# EAGLE design untitled2 (EAGLE 7.2.0)
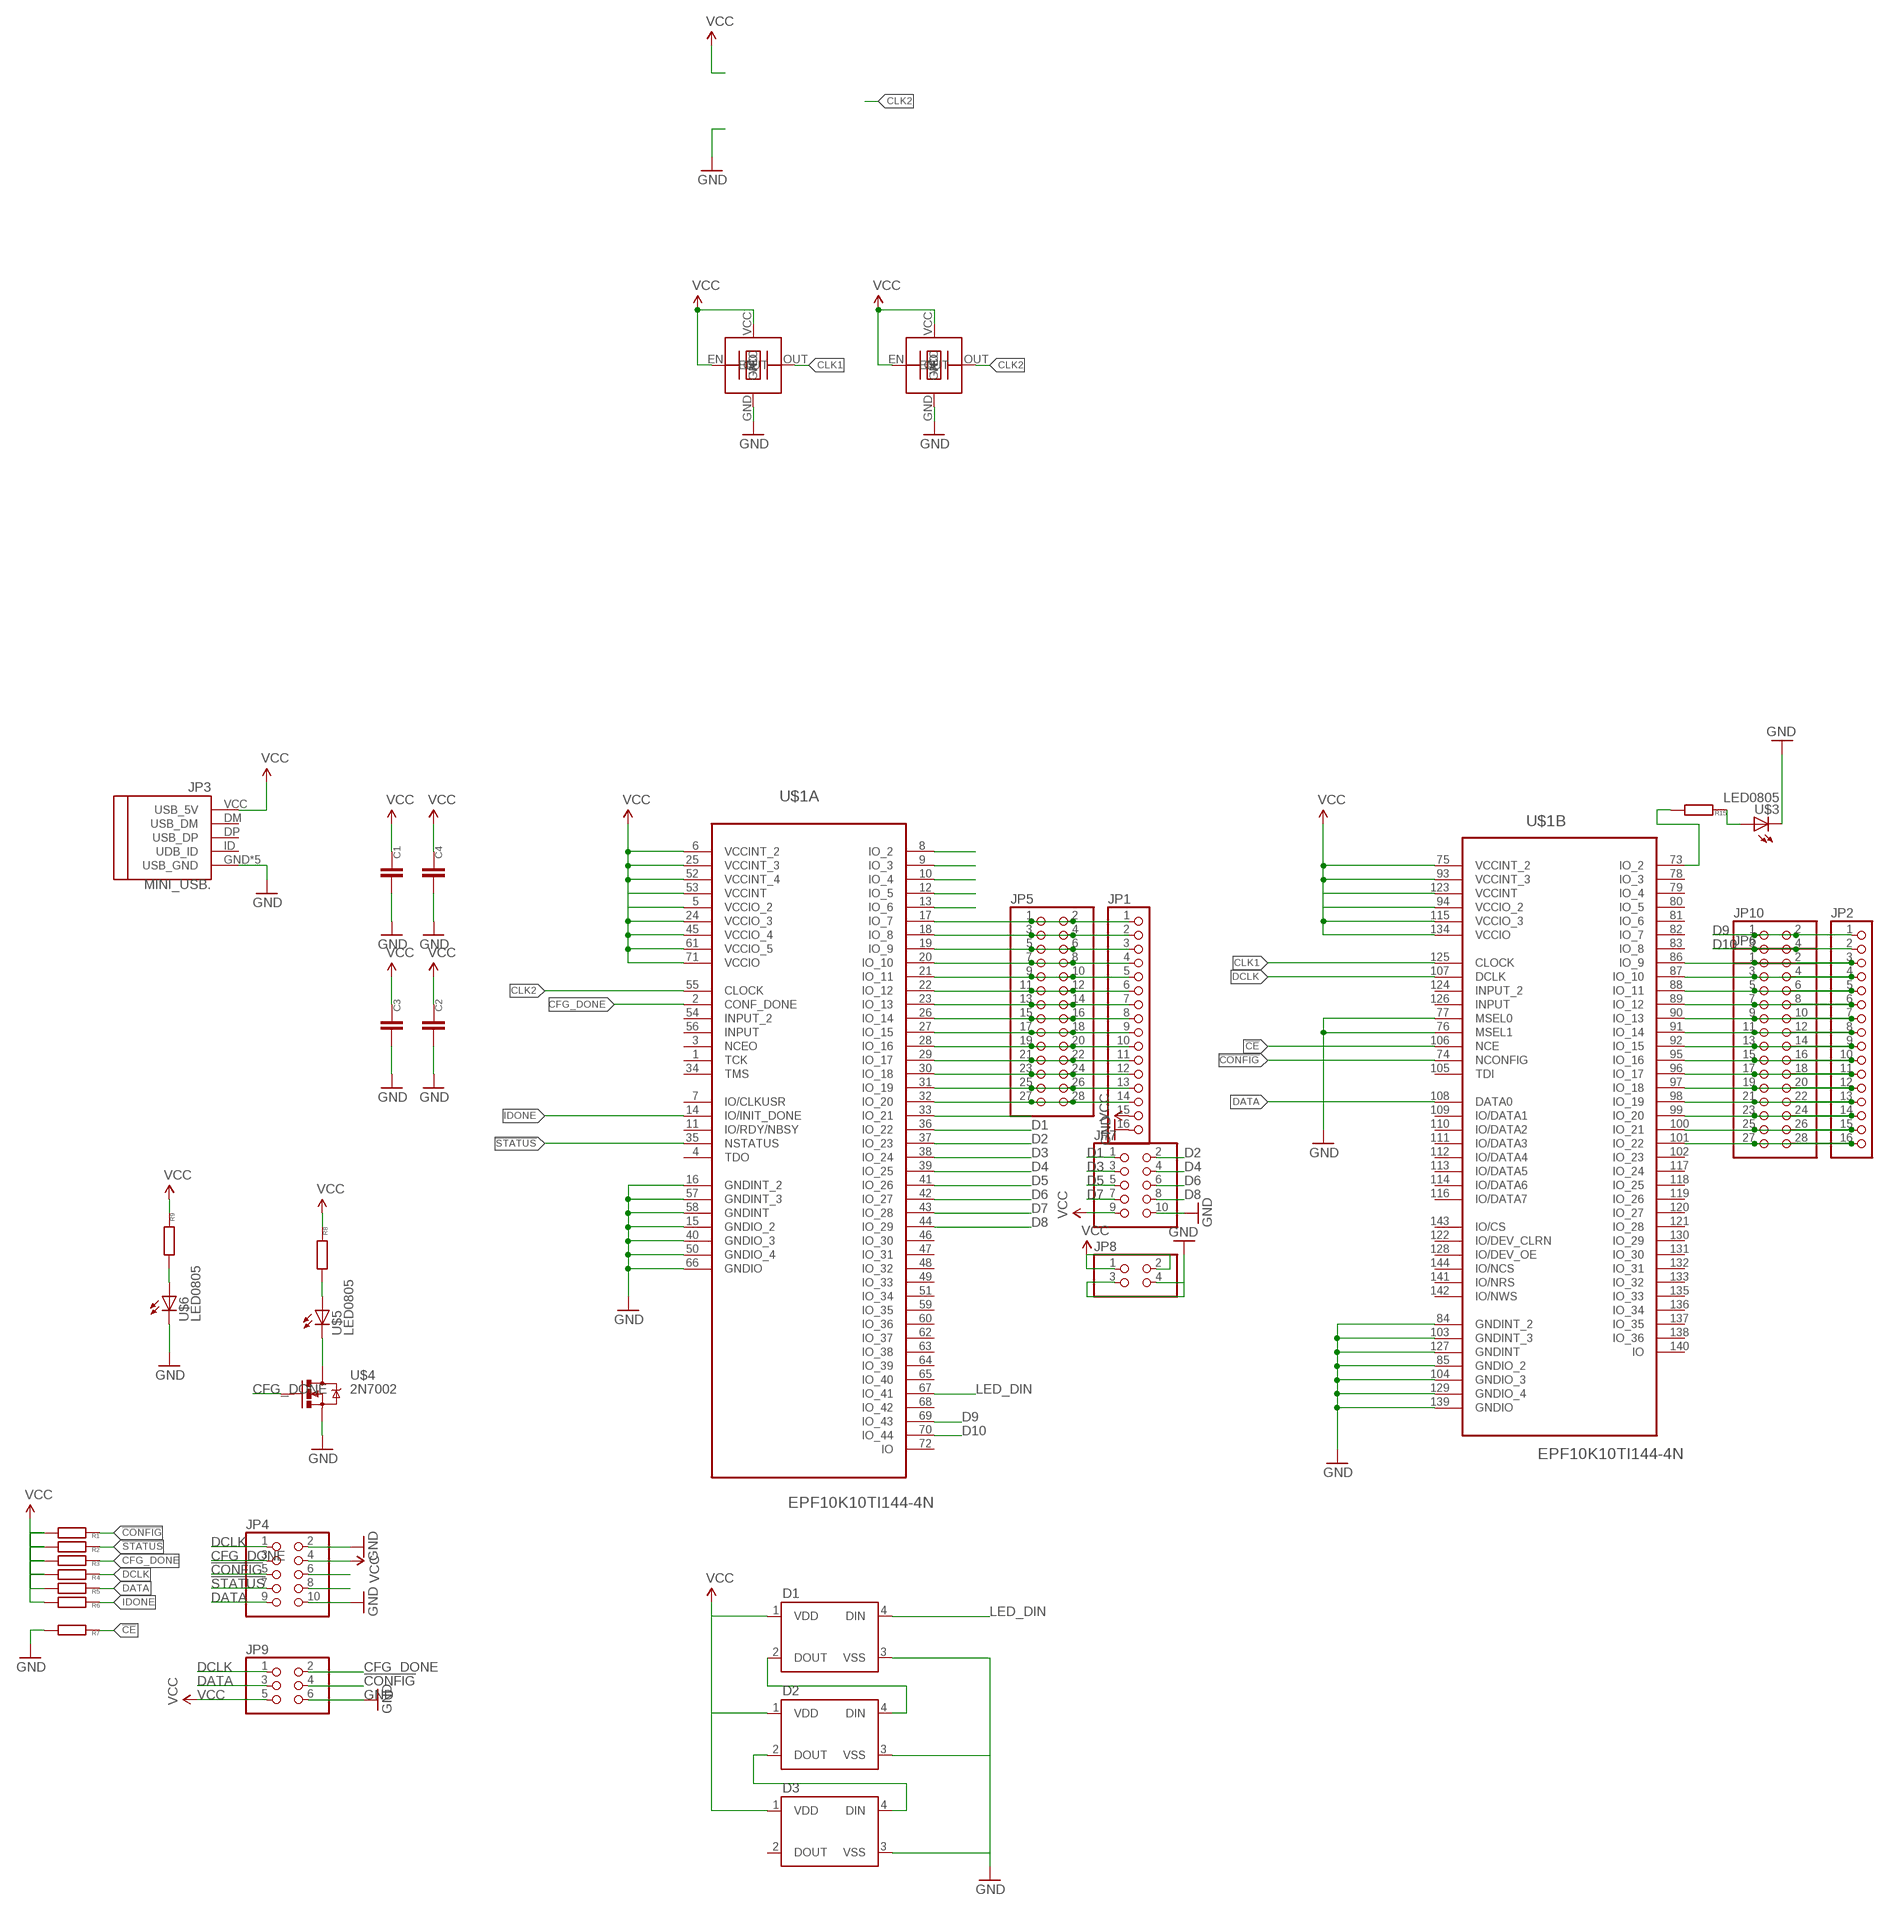
[diagram p0: schematic, sheet 1]

## Parts
C1  CC0805  [C0805]
C2  CC0805  [C0805]
C3  CC0805  [C0805]
C4  CC0805  [C0805]
D1  WS2812B  [WS2812B]
D2  WS2812B  [WS2812B]
D3  WS2812B  [WS2812B]
JP1  PINHD-1X16_2.54  [1X16]
JP2  PINHD-1X16_2.54  [1X16]
JP3  MINI_USB.  [32005-201]
JP4  PINHD-2X05_2.54-SMD  [2X05SMD]
JP5  PINHD-2X14_2.54-SMD  [2X14SMD]
JP6  PINHD-2X14_2.54-SMD  [2X14SMD]
JP7  PINHD-2X05_2.54-SMD  [2X05SMD]
JP8  PINHD-2X02_2.54-SMD  [2X02SMD]
JP9  PINHD-2X03_2.54-SMD  [2X03SMD]
JP10  PINHD-2X02_2.54-SMD  [2X02SMD]
R1  R0603  [0603]
R2  R0603  [0603]
R3  R0603  [0603]
R4  R0603  [0603]
R5  R0603  [0603]
R6  R0603  [0603]
R7  R0603  [0603]
R8  R0603  [0603]
R9  R0603  [0603]
R15  R0603  [0603]
U$1  EPF10K10TI144-4N  [QFP50P2200X2200X160-144N]
U$2  TXC-BA  [7X5]
U$3  LED0805  [0805-LED]
U$4  2N7002  [SOT23]
U$5  LED0805  [0805-LED]
U$6  LED0805  [0805-LED]
U$7  TXC-BA  [7X5]

## Nets
!CE: R7.1 U$1.106(B:NCE)
!CONFIG: JP4.5 JP9.4 R1.1 U$1.74(B:NCONFIG)
!STATUS: JP4.7 R2.1 U$1.35(A:NSTATUS)
CFG_DONE: JP4.3 JP9.2 R3.1 U$1.2(A:CONF_DONE) U$4.1(G)
CLK1: U$1.125(B:CLOCK) U$2.OUT
CLK2: U$1.55(A:CLOCK) U$7.OUT
D1: JP7.1 U$1.36(A:IO_22)
D2: JP7.2 U$1.37(A:IO_23)
D3: JP7.3 U$1.38(A:IO_24)
D4: JP7.4 U$1.39(A:IO_25)
D5: JP7.5 U$1.41(A:IO_26)
D6: JP7.6 U$1.42(A:IO_27)
D7: JP7.7 U$1.43(A:IO_28)
D8: JP7.8 U$1.44(A:IO_29)
D9: JP2.1 JP10.1 JP10.2 U$1.69(A:IO_43)
D10: JP2.2 JP10.3 JP10.4 U$1.70(A:IO_44)
DATA: JP4.9 JP9.3 R5.1 U$1.108(B:DATA0)
DCLK: JP4.1 JP9.1 R4.1 U$1.107(B:DCLK)
GND: C1.1 C2.1 C3.1 C4.1 D1.3(VSS) D2.3(VSS) D3.3(VSS) JP1.16 JP3.GND(USB_GND) JP3.M1(USB_GND) JP3.M2(USB_GND) JP3.M3(USB_GND) JP3.M4(USB_GND) JP4.2 JP4.10 JP7.10 JP8.3 JP8.4 JP9.6 R7.2 U$1.15(A:GNDIO_2) U$1.16(A:GNDINT_2) U$1.40(A:GNDIO_3) U$1.50(A:GNDIO_4) U$1.57(A:GNDINT_3) U$1.58(A:GNDINT) U$1.66(A:GNDIO) U$1.76(B:MSEL1) U$1.77(B:MSEL0) U$1.84(B:GNDINT_2) U$1.85(B:GNDIO_2) U$1.103(B:GNDINT_3) U$1.104(B:GNDIO_3) U$1.127(B:GNDINT) U$1.129(B:GNDIO_4) U$1.139(B:GNDIO) U$2.GND U$3.C U$4.2(S) U$6.C U$7.GND
IDONE: R6.1 U$1.14(A:IO/INIT_DONE)
LED_DIN: D1.4(DIN) U$1.67(A:IO_41)
N$1: JP2.11 JP6.17 JP6.18 U$1.96(B:IO_17)
N$3: U$1.8(A:IO_2)
N$4: JP2.12 JP6.19 JP6.20 U$1.97(B:IO_18)
N$7: U$1.9(A:IO_3)
N$8: U$1.10(A:IO_4)
N$9: U$1.12(A:IO_5)
N$10: U$1.13(A:IO_6)
N$11: JP1.1 JP5.1 JP5.2 U$1.17(A:IO_7)
N$12: JP1.2 JP5.3 JP5.4 U$1.18(A:IO_8)
N$13: R15.2 U$1.73(B:IO_2)
N$14: R15.1 U$3.A
N$15: JP2.13 JP6.21 JP6.22 U$1.98(B:IO_19)
N$16: JP1.3 JP5.5 JP5.6 U$1.19(A:IO_9)
N$17: JP1.4 JP5.7 JP5.8 U$1.20(A:IO_10)
N$18: JP1.5 JP5.9 JP5.10 U$1.21(A:IO_11)
N$19: JP1.6 JP5.11 JP5.12 U$1.22(A:IO_12)
N$20: JP1.7 JP5.13 JP5.14 U$1.23(A:IO_13)
N$21: JP1.8 JP5.15 JP5.16 U$1.26(A:IO_14)
N$22: JP1.9 JP5.17 JP5.18 U$1.27(A:IO_15)
N$23: JP1.10 JP5.19 JP5.20 U$1.28(A:IO_16)
N$24: JP1.11 JP5.21 JP5.22 U$1.29(A:IO_17)
N$25: JP1.12 JP5.23 JP5.24 U$1.30(A:IO_18)
N$26: JP1.13 JP5.25 JP5.26 U$1.31(A:IO_19)
N$27: JP1.14 JP5.27 JP5.28 U$1.32(A:IO_20)
N$28: U$1.33(A:IO_21)
N$30: R9.2 U$6.A
N$31: U$4.3(D) U$5.C
N$32: R8.2 U$5.A
N$35: D1.2(DOUT) D2.4(DIN)
N$36: D2.2(DOUT) D3.4(DIN)
N$38: JP2.14 JP6.23 JP6.24 U$1.99(B:IO_20)
N$39: JP2.15 JP6.25 JP6.26 U$1.100(B:IO_21)
N$40: JP2.16 JP6.27 JP6.28 U$1.101(B:IO_22)
N$41: JP2.3 JP6.1 JP6.2 U$1.86(B:IO_9)
N$42: JP2.4 JP6.3 JP6.4 U$1.87(B:IO_10)
N$43: JP2.5 JP6.5 JP6.6 U$1.88(B:IO_11)
N$44: JP2.6 JP6.7 JP6.8 U$1.89(B:IO_12)
N$45: JP2.7 JP6.9 JP6.10 U$1.90(B:IO_13)
N$46: JP2.8 JP6.11 JP6.12 U$1.91(B:IO_14)
N$47: JP2.9 JP6.13 JP6.14 U$1.92(B:IO_15)
N$48: JP2.10 JP6.15 JP6.16 U$1.95(B:IO_16)
N$56: JP4.6
N$57: JP4.8
VCC: C1.2 C2.2 C3.2 C4.2 D1.1(VDD) D2.1(VDD) D3.1(VDD) JP1.15 JP3.VCC(USB_5V) JP4.4 JP7.9 JP8.1 JP8.2 JP9.5 R1.2 R2.2 R3.2 R4.2 R5.2 R6.2 R8.1 R9.1 U$1.5(A:VCCIO_2) U$1.6(A:VCCINT_2) U$1.24(A:VCCIO_3) U$1.25(A:VCCINT_3) U$1.45(A:VCCIO_4) U$1.52(A:VCCINT_4) U$1.53(A:VCCINT) U$1.61(A:VCCIO_5) U$1.71(A:VCCIO) U$1.75(B:VCCINT_2) U$1.93(B:VCCINT_3) U$1.94(B:VCCIO_2) U$1.115(B:VCCIO_3) U$1.123(B:VCCINT) U$1.134(B:VCCIO) U$2.EN U$2.VCC U$7.EN U$7.VCC
Unconnected: D3.2(DOUT) JP3.DM(USB_DM) JP3.DP(USB_DP) JP3.ID(UDB_ID) U$1.1(A:TCK) U$1.3(A:NCEO) U$1.4(A:TDO) U$1.7(A:IO/CLKUSR) U$1.11(A:IO/RDY/NBSY) U$1.34(A:TMS) U$1.46(A:IO_30) U$1.47(A:IO_31) U$1.48(A:IO_32) U$1.49(A:IO_33) U$1.51(A:IO_34) U$1.54(A:INPUT_2) U$1.56(A:INPUT) U$1.59(A:IO_35) U$1.60(A:IO_36) U$1.62(A:IO_37) U$1.63(A:IO_38) U$1.64(A:IO_39) U$1.65(A:IO_40) U$1.68(A:IO_42) U$1.72(A:IO) U$1.78(B:IO_3) U$1.79(B:IO_4) U$1.80(B:IO_5) U$1.81(B:IO_6) U$1.82(B:IO_7) U$1.83(B:IO_8) U$1.102(B:IO_23) U$1.105(B:TDI) U$1.109(B:IO/DATA1) U$1.110(B:IO/DATA2) U$1.111(B:IO/DATA3) U$1.112(B:IO/DATA4) U$1.113(B:IO/DATA5) U$1.114(B:IO/DATA6) U$1.116(B:IO/DATA7) U$1.117(B:IO_24) U$1.118(B:IO_25) U$1.119(B:IO_26) U$1.120(B:IO_27) U$1.121(B:IO_28) U$1.122(B:IO/DEV_CLRN) U$1.124(B:INPUT_2) U$1.126(B:INPUT) U$1.128(B:IO/DEV_OE) U$1.130(B:IO_29) U$1.131(B:IO_30) U$1.132(B:IO_31) U$1.133(B:IO_32) U$1.135(B:IO_33) U$1.136(B:IO_34) U$1.137(B:IO_35) U$1.138(B:IO_36) U$1.140(B:IO) U$1.141(B:IO/NRS) U$1.142(B:IO/NWS) U$1.143(B:IO/CS) U$1.144(B:IO/NCS)

## Library data of the parts
C1-C4 = smalsmd:C: Capacitor
D1-D3 = SparkFun-LED:WS2812B: WS2812B - Intelligent control LED integrated light source Technical Specifications: Power Supply Voltage (VDD): 3.5 to 5.3 V Input Voltage (VI): -0.5 to VDD+0.5 V Operating Junction Temperature (Topt): -25°C to +80°C Storage Temperature Range (Tstg): -55°C to +150°C; PROD_ID: DIO-12503
JP1 JP2 = pinhead-2:PINHD-1X16: PIN HEADER
JP3 = connectors:MINI_USB
JP4 JP7 = pinhead-2:PINHD-2X05: PIN HEADER
JP5 JP6 = pinhead-2:PINHD-2X14: PIN HEADER
JP8 JP10 = pinhead-2:PINHD-2X02: PIN HEADER
JP9 = pinhead-2:PINHD-2X03: PIN HEADER
R1-R9 R15 = smalsmd:R
U$1 = Altera_By_element14_Batch_1:EPF10K10TI144-4N: Embedded Programmable Logic Device; MPN: EPF10K10TI144-4N; OC_FARNELL: -; OC_NEWARK: 51R8776; PACKAGE: QFP-144; SUPPLIER: Altera
U$2 U$7 = txc:TXC-BA**
U$3 U$5 U$6 = smalsmd:LED
U$4 = smalsmd:2N7002

## Board
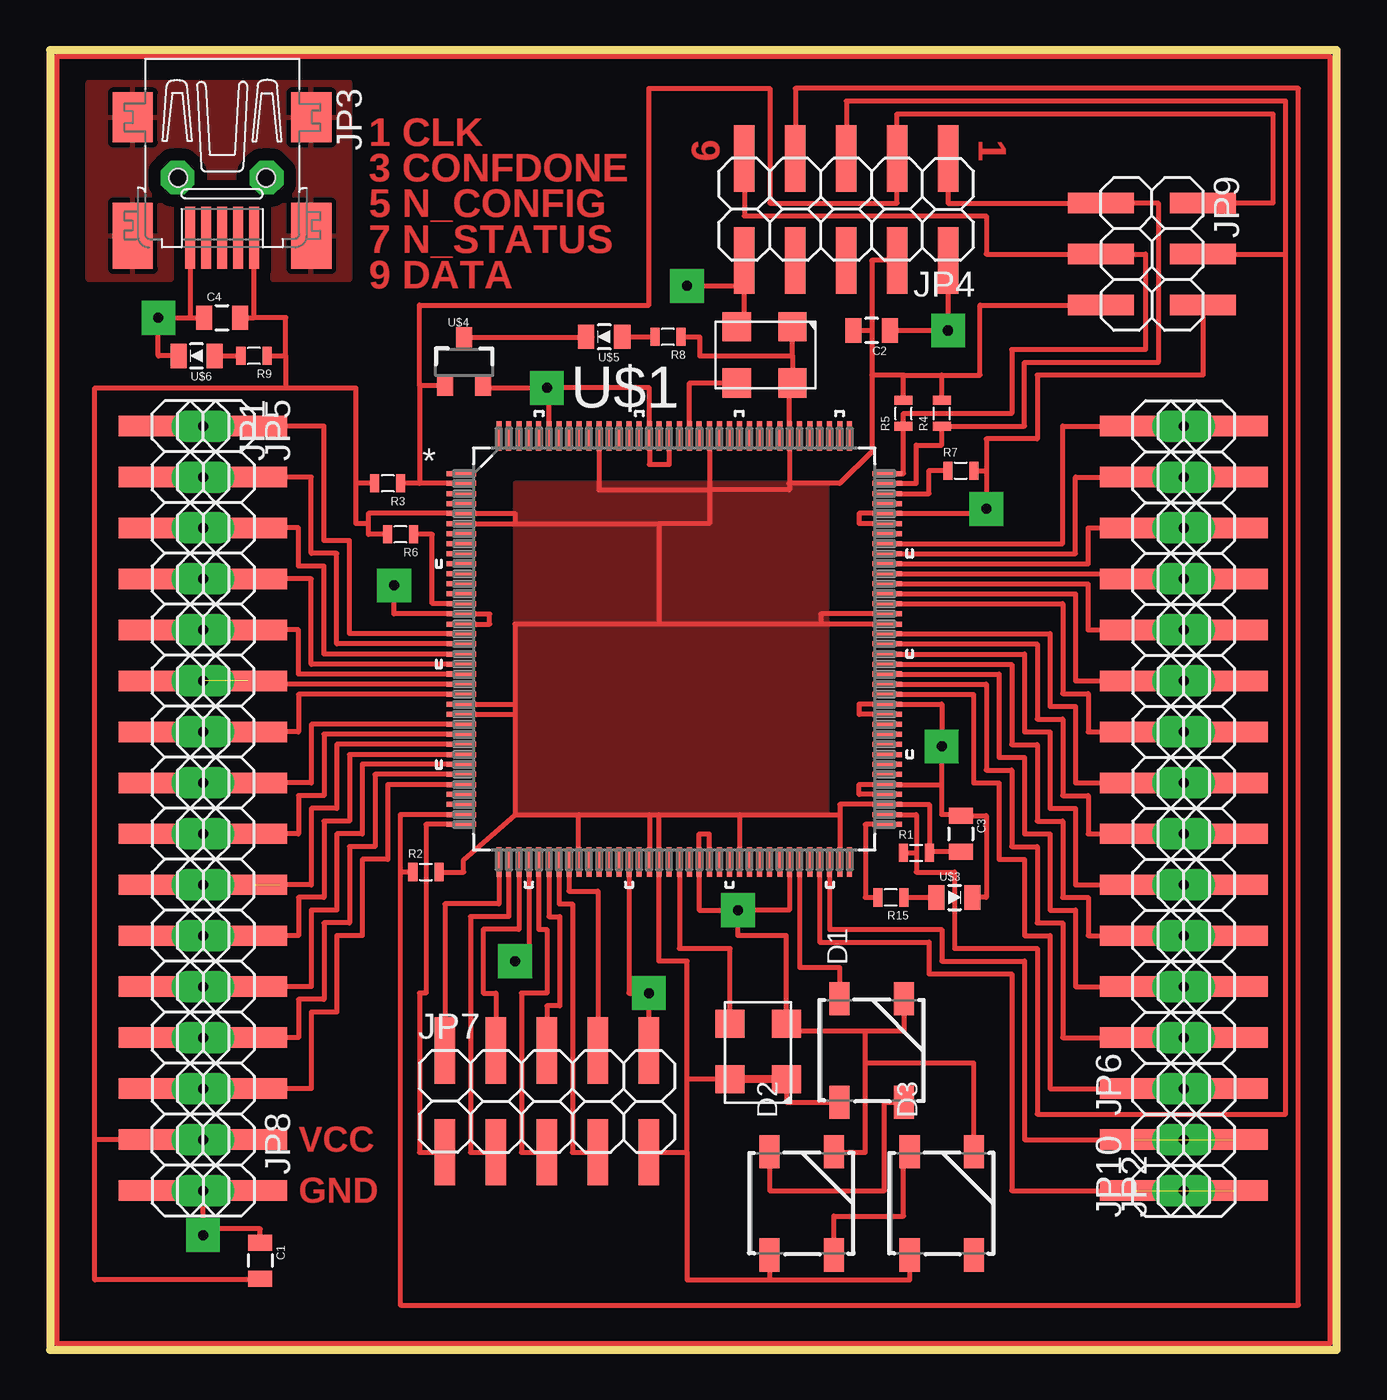
[diagram p1: board, top side]
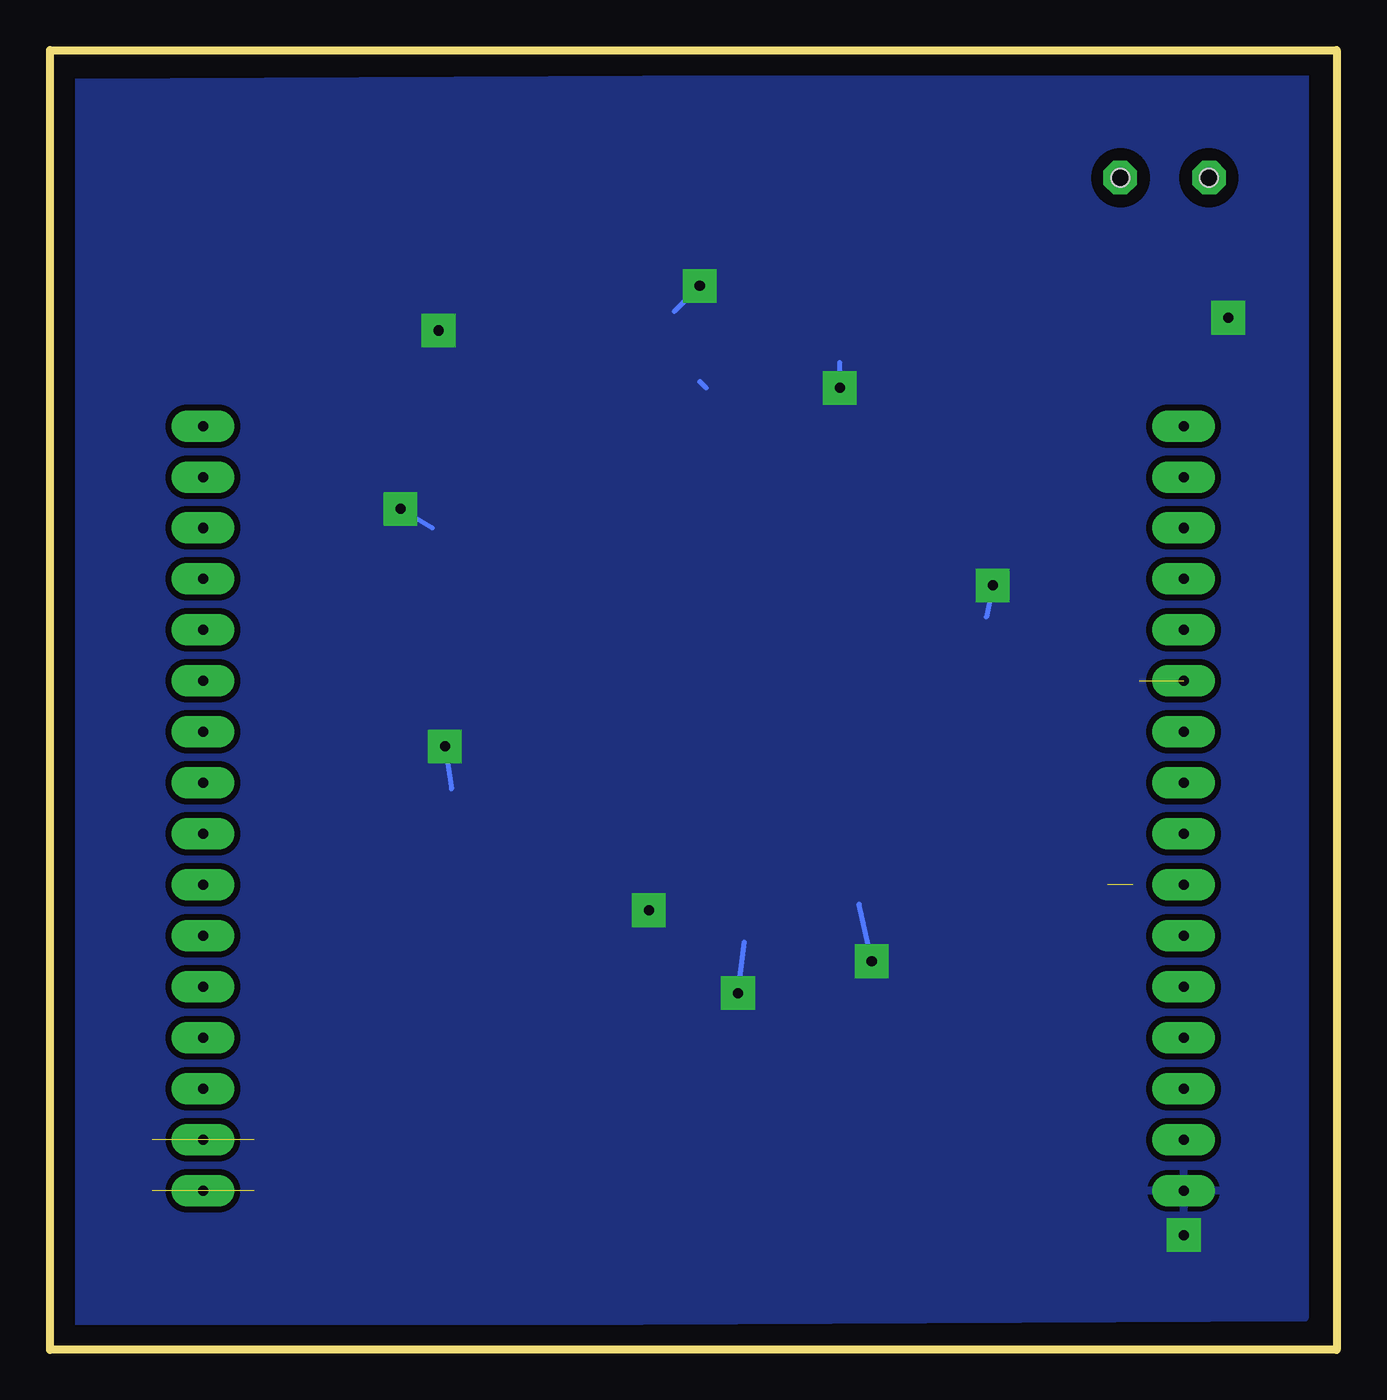
[diagram p2: board, bottom side, seen from below]

Size 64.14 x 64.77 mm. Coordinates in mm from the lower left corner, seen from the top.
Outline: 0,0 64.14,0 64.14,64.77 0,64.77 0,0
Copper layers (1*16): Top 0.035mm / dielectric 1.5mm / Bottom 0.035mm
Design rules "my02": minimum track width 0.2mm, minimum drill 0.2mm, track to track 0.2mm, track to pad 0.2mm, pad to pad 0.2mm, via to via 0.2mm, smd to smd 0.2mm, copper to edge 40mil, drill to drill 8mil, minimum pad ring 10mil, minimum via ring 8mil, stop-mask expansion 4mil, vias tented up to drill 0mil, thermal gap 10mil

### Footprints (pad centres in the part's own frame; a part is rotated, then mirrored left to right if it is on the bottom)
C0805 = smd 0.8 x 1.2: 1 -0.9,0; 2 0.9,0
WS2812B = smd 1.651 x 1: 1 -2.577,1.6; 2 -2.577,-1.6; 3 2.577,-1.6; 4 2.577,1.6
1X16 = drill 0.5 pad 1.57 long: 1 -19.05,0; 2 -16.51,0; 3 -13.97,0; 4 -11.43,0; 5 -8.89,0; 6 -6.35,0; 7 -3.81,0; 8 -1.27,0; 9 1.27,0; 10 3.81,0; 11 6.35,0; 12 8.89,0; 13 11.43,0; 14 13.97,0; 15 16.51,0; 16 19.05,0
32005-201 = smd 3.1 x 0.5: DM 3,0.8; DP 3,0; GND 3,-1.6; ID 3,-0.8; VCC 3,1.6 | smd 2.5 x 2: M1 -3,-4.45; M2 -3,4.45 | smd 3.3 x 2: M3 2.9,4.45; M4 2.9,-4.45 | hole 0.9: 0,2.2; 0,-2.2
2X05SMD = smd 1.016 x 3.302: 1 -1.27,-3.81; 2 -1.27,1.27; 3 1.27,-3.81; 4 1.27,1.27; 5 3.81,-3.81; 6 3.81,1.27; 7 6.35,-3.81; 8 6.35,1.27; 9 8.89,-3.81; 10 8.89,1.27
2X14SMD = smd 1.016 x 3.302: 1 -1.27,-3.81; 2 -1.27,1.27; 3 1.27,-3.81; 4 1.27,1.27; 5 3.81,-3.81; 6 3.81,1.27; 7 6.35,-3.81; 8 6.35,1.27; 9 8.89,-3.81; 10 8.89,1.27; 11 11.43,-3.81; 12 11.43,1.27; 13 13.97,-3.81; 14 13.97,1.27; 15 16.51,-3.81; 16 16.51,1.27; 17 19.05,-3.81; 18 19.05,1.27; 19 21.59,-3.81; 20 21.59,1.27; 21 24.13,-3.81; 22 24.13,1.27; 23 26.67,-3.81; 24 26.67,1.27; 25 29.21,-3.81; 26 29.21,1.27; 27 31.75,-3.81; 28 31.75,1.27
2X02SMD = smd 1.016 x 3.302: 1 -1.27,-3.81; 2 -1.27,1.27; 3 1.27,-3.81; 4 1.27,1.27
2X03SMD = smd 1.016 x 3.302: 1 -1.27,-3.81; 2 -1.27,1.27; 3 1.27,-3.81; 4 1.27,1.27; 5 3.81,-3.81; 6 3.81,1.27
0603 = smd 0.45 x 0.9: 1 -0.65,0; 2 0.65,0
QFP50P2200X2200X160-144N = smd 1.473 x 0.25: 1 -10.617,8.738; 2 -10.617,8.255; 3 -10.617,7.747; 4 -10.617,7.239; 5 -10.617,6.756; 6 -10.617,6.248; 7 -10.617,5.74; 8 -10.617,5.258; 9 -10.617,4.75; 10 -10.617,4.242; 11 -10.617,3.759; 12 -10.617,3.251; 13 -10.617,2.743; 14 -10.617,2.261; 15 -10.617,1.753; 16 -10.617,1.245; 17 -10.617,0.762; 18 -10.617,0.254; 19 -10.617,-0.254; 20 -10.617,-0.762; 21 -10.617,-1.245; 22 -10.617,-1.753; 23 -10.617,-2.261; 24 -10.617,-2.743; 25 -10.617,-3.251; 26 -10.617,-3.759; 27 -10.617,-4.242; 28 -10.617,-4.75; 29 -10.617,-5.258; 30 -10.617,-5.74; 31 -10.617,-6.248; 32 -10.617,-6.756; 33 -10.617,-7.239; 34 -10.617,-7.747; 35 -10.617,-8.255; 36 -10.617,-8.738; 73 10.617,-8.738; 74 10.617,-8.255; 75 10.617,-7.747; 76 10.617,-7.239; 77 10.617,-6.756; 78 10.617,-6.248; 79 10.617,-5.74; 80 10.617,-5.258; 81 10.617,-4.75; 82 10.617,-4.242; 83 10.617,-3.759; 84 10.617,-3.251; 85 10.617,-2.743; 86 10.617,-2.261; 87 10.617,-1.753; 88 10.617,-1.245; 89 10.617,-0.762; 90 10.617,-0.254; 91 10.617,0.254; 92 10.617,0.762; 93 10.617,1.245; 94 10.617,1.753; 95 10.617,2.261; 96 10.617,2.743; 97 10.617,3.251; 98 10.617,3.759; 99 10.617,4.242; 100 10.617,4.75; 101 10.617,5.258; 102 10.617,5.74; 103 10.617,6.248; 104 10.617,6.756; 105 10.617,7.239; 106 10.617,7.747; 107 10.617,8.255; 108 10.617,8.738 | smd 0.25 x 1.473: 37 -8.738,-10.617; 38 -8.255,-10.617; 39 -7.747,-10.617; 40 -7.239,-10.617; 41 -6.756,-10.617; 42 -6.248,-10.617; 43 -5.74,-10.617; 44 -5.258,-10.617; 45 -4.75,-10.617; 46 -4.242,-10.617; 47 -3.759,-10.617; 48 -3.251,-10.617; 49 -2.743,-10.617; 50 -2.261,-10.617; 51 -1.753,-10.617; 52 -1.245,-10.617; 53 -0.762,-10.617; 54 -0.254,-10.617; 55 0.254,-10.617; 56 0.762,-10.617; 57 1.245,-10.617; 58 1.753,-10.617; 59 2.261,-10.617; 60 2.743,-10.617; 61 3.251,-10.617; 62 3.759,-10.617; 63 4.242,-10.617; 64 4.75,-10.617; 65 5.258,-10.617; 66 5.74,-10.617; 67 6.248,-10.617; 68 6.756,-10.617; 69 7.239,-10.617; 70 7.747,-10.617; 71 8.255,-10.617; 72 8.738,-10.617; 109 8.738,10.617; 110 8.255,10.617; 111 7.747,10.617; 112 7.239,10.617; 113 6.756,10.617; 114 6.248,10.617; 115 5.74,10.617; 116 5.258,10.617; 117 4.75,10.617; 118 4.242,10.617; 119 3.759,10.617; 120 3.251,10.617; 121 2.743,10.617; 122 2.261,10.617; 123 1.753,10.617; 124 1.245,10.617; 125 0.762,10.617; 126 0.254,10.617; 127 -0.254,10.617; 128 -0.762,10.617; 129 -1.245,10.617; 130 -1.753,10.617; 131 -2.261,10.617; 132 -2.743,10.617; 133 -3.251,10.617; 134 -3.759,10.617; 135 -4.242,10.617; 136 -4.75,10.617; 137 -5.258,10.617; 138 -5.74,10.617; 139 -6.248,10.617; 140 -6.756,10.617; 141 -7.239,10.617; 142 -7.747,10.617; 143 -8.255,10.617; 144 -8.738,10.617
7X5 = smd 1.4 x 1.45: EN -1.448,-1.465; GND 1.333,-1.465; OUT 1.333,1.345; VCC -1.448,1.345
0805-LED = smd 0.8 x 1.2: A -0.9,0; C 0.9,0
SOT23 = smd 0.8 x 1: 1 -0.95,-1.159; 2 0.95,-1.159; 3 0,1.259

### Placement (x,y rotation side)
C1  10.48,4.45 270 top
C2  40.96,50.8 180 top
C3  45.4,25.72 270 top
C4  8.57,51.44 0 top
D1  40.96,14.92 90 top
D2  37.47,7.3 90 top
D3  44.45,7.3 90 top
JP1  7.62,26.99 270 top
JP2  56.52,26.99 90 top
JP3  8.57,58.42 270 top
JP4  43.5,55.56 180 top
JP5  8.89,44.77 270 top
JP6  55.25,14.29 90 top
JP7  20.95,13.65 0 top
JP8  8.89,9.21 270 top
JP9  56.2,55.88 270 top
JP10  55.25,9.21 90 top
R1  43.18,24.77 0 top
R2  18.73,23.81 0 top
R3  16.83,43.18 180 top
R4  44.45,46.67 90 top
R5  42.55,46.67 90 top
R6  17.46,40.64 180 top
R7  45.4,43.81 0 top
R8  30.8,50.48 180 top
R9  10.16,49.53 180 top
R15  41.91,22.54 180 top
U$1  31.11,34.93 0 top
U$2  TXC-BA*  [7X5]  35.56,49.53 180 top
U$3  45.09,22.54 0 top
U$4  20.64,49.21 0 top
U$5  27.62,50.48 180 top
U$6  7.3,49.53 180 top
U$7  TXC-BA*  [7X5]  35.24,14.92 90 top

### Tracks (layer width: path | path; a pad name or v marks a point on that pad's centre or on a via)
!CE
  Top 0.254: U$1.106 43.82,42.67 43.82,43.81 R7.1
!CONFIG
  Top 0.254: JP4.5 39.69,62.23 61.6,62.23 61.6,54.61 | U$1.74 43.18,26.67 43.18,24.77 | R1.1 43.18,24.77 | 43.18,24.77 43.18,23.81 45.09,23.81 45.09,20 49.21,20 49.21,11.75 61.6,11.75 61.6,54.61 | JP9.4 61.6,54.61
!STATUS
  Top 0.254: U$1.35 17.46,26.67 | JP4.7 37.15,62.87 62.23,62.87 62.23,2.22 17.46,2.22 17.46,23.81 | 17.46,23.81 17.46,26.67 | 17.45,26.67 17.46,26.67 | R2.1 17.46,23.81
CFG_DONE
  Top 0.254: U$4.1 18.41,48.05 | 18.41,48.05 18.41,52.07 29.84,52.07 29.84,62.87 35.88,62.87 35.88,57.15 42.23,57.15 JP4.3 42.23,61.59 60.96,61.59 60.96,57.15 JP9.2 | U$1.2 18.41,43.18 | 18.41,43.18 R3.1 | 18.41,48.05 18.41,43.18
CLK1
  Top 0.254: U$1.125 31.88,48.19 U$2.OUT
CLK2
  Top 0.254: U$1.55 31.37,20 33.9,20 U$7.OUT
D1
  Top 0.254: U$1.36 18.73,26.19 18.73,17.78 18.41,17.78 18.41,9.84 JP7.1
D2
  Top 0.254: U$1.37 22.38,22.23 19.68,22.23 JP7.2
D3
  Top 0.254: U$1.38 22.86,21.59 20.95,21.59 20.95,9.84 JP7.3
D4
  Top 0.254: U$1.39 23.37,20.96 21.59,20.96 21.59,17.78 22.22,17.78 JP7.4
D5
  Top 0.254: U$1.41 24.36,20.96 24.77,20.96 24.77,17.78 23.5,17.78 23.5,9.84 JP7.5
D6
  Top 0.254: U$1.42 24.87,21.59 25.4,21.59 25.4,17.14 24.77,17.14 JP7.6
D7
  Top 0.254: U$1.43 25.38,22.23 26.04,22.23 26.04,9.84 JP7.7
D8
  Top 0.254: U$1.44 25.86,22.86 27.3,22.86 JP7.8
D9  (2 unrouted)
  Top 0.254: U$1.69 38.35,20.32 43.82,20.32 43.82,18.73 47.94,18.73 47.94,7.94 JP2.1
D10  (2 unrouted)
  Top 0.254: U$1.70 38.86,20.96 44.45,20.96 44.45,19.37 48.58,19.37 48.58,10.48 JP2.2
DATA
  Top 0.254: U$1.108 42.55,43.66 R5.1 42.55,46.67 47.94,46.67 47.94,49.85 54.61,49.85 54.61,54.61 JP9.3 46.67,54.61 46.67,56.52 34.61,56.52 JP4.9
DCLK
  Top 0.254: U$1.107 43.18,43.18 43.18,45.09 44.45,45.09 R4.1 44.77,46.04 48.58,46.04 48.58,49.21 55.25,49.21 55.25,57.15 JP9.1 44.77,57.15 JP4.1
GND  (via drill 0.5 pad 1.68)
  Top 0.254: U$1.76 40.32,27.69 40.32,28.17 U$1.77 44.45,28.17 | U$1.84 40.32,31.67 40.32,32.18 U$1.85 44.45,32.18 v44.45,30.07 44.45,28.17 | U$1.103 40.32,41.17 40.32,41.68 U$1.104 46.58,41.68 v46.67,41.91 46.67,43.81 | U$1.127 30.86,44.13 29.87,44.13 U$1.129 29.87,47.94 24.87,47.94 | U$1.16 21.91,36.17 21.91,36.68 U$1.15 17.14,36.68 v17.14,38.1 | U$1.139 24.87,47.94 | 24.87,47.94 v24.77,47.94 21.59,47.94 U$4.2 | U$1.66 36.86,21.91 v34.29,21.91 | U$1.58 32.87,25.72 32.36,25.72 U$1.57 32.36,21.91 v34.29,21.91 | U$1.40 23.88,19.37 v23.18,19.37 | JP3.GND 6.98,54.47 6.98,51.44 | 6.98,51.44 v5.4,51.44 5.4,49.53 U$6.C | 6.98,51.44 C4.1 | JP4.2 v44.77,50.8 C2.1 | JP7.10 v29.84,17.78 28.85,17.78 U$1.50 | JP8.3 JP1.16 | JP1.16 JP8.4 | U$2.GND 34.55,51.12 34.61,51.12 JP4.10 34.61,53.02 v31.75,53.02 | R7.2 46.67,43.81 | JP1.16 v7.62,5.71 7.62,6.03 10.48,6.03 C1.1 | 44.45,28.17 44.45,26.67 45.72,26.67 C3.1 46.67,26.62 46.67,22.54 U$3.C | JP9.6 57.47,48.58 49.21,48.58 49.21,45.4 46.67,45.4 46.67,43.81 | D1.3 42.56,15.88 40.64,15.88 | 40.64,15.88 36.71,15.88 U$7.GND 36.71,20.64 34.29,20.64 v34.29,21.91 | D2.3 39.38,9.84 40.64,9.84 40.64,14.29 | 40.64,14.29 40.64,15.88 | D3.3 46.05,14.29 40.64,14.29
  Bottom 0.254: v44.45,30.07 44.13,27.94 | v46.67,41.91 45.09,40.96 | 31.43,47.94 31.75,48.26 | v17.14,38.1 17.46,36.51 | v24.77,47.94 24.77,49.21 | v23.18,19.37 23.81,22.23 | v29.84,17.78 29.53,20.32 | v34.29,21.91 34.29,22.54 | v5.4,51.44 5.08,51.12 5.08,50.8 | v31.75,53.02 33.02,51.75
  pour Bottom (isolate 0.305, rank 6): 1.59,1.59 62.87,1.27 62.87,63.18 1.59,63.5
  pour Top (isolate 0.61): 6.03,53.34 1.91,53.34 1.91,63.18 14.92,63.18 14.92,53.34 11.11,53.34 11.11,58.42 6.03,58.42
IDONE
  Top 0.254: U$1.14 19.05,37.19 19.05,40.64 R6.1
LED_DIN
  Top 0.254: U$1.67 37.36,19.05 39.37,19.05 D1.4 39.37,17.51
N$1
  Top 0.254: U$1.96 51.12,37.67 51.12,33.34 JP2.11 JP6.18 | 53.34,33.34 JP6.18 | JP6.18 JP6.17
N$4
  Top 0.254: U$1.97 51.75,38.18 51.75,35.88 JP2.12 JP6.20 JP6.19
N$11
  Top 0.254: U$1.17 14.92,35.69 14.92,40.32 13.65,40.32 13.65,46.04 JP1.1 JP5.2 JP5.1
N$12
  Top 0.254: U$1.18 14.29,35.18 14.29,39.69 13.02,39.69 13.02,43.5 JP1.2 JP5.4 JP5.3
N$13
  Top 0.254: U$1.73 40.64,26.19 40.64,22.54 R15.2
N$14
  Top 0.254: R15.1 U$3.A
N$15
  Top 0.254: U$1.98 53.66,38.68 53.66,38.42 JP2.13 JP6.22 JP6.21
N$16
  Top 0.254: U$1.19 13.65,34.67 13.65,39.05 12.38,39.05 12.38,40.96 JP1.3 JP5.6 JP5.5
N$17
  Top 0.254: U$1.20 13.02,34.16 13.02,38.42 JP1.4 JP5.8 JP5.7
N$18
  Top 0.254: U$1.21 12.38,33.68 12.38,35.88 JP1.5 JP5.10 JP5.9
N$19  (1 unrouted)
  Top 0.254: U$1.22 9.84,33.17 9.84,33.34 | 9.84,33.34 JP5.11 | JP5.12 9.84,33.34
N$20
  Top 0.254: U$1.23 12.38,32.66 12.38,30.8 JP1.7 JP5.14 JP5.13
N$21
  Top 0.254: U$1.26 13.02,31.17 13.02,28.26 JP1.8 JP5.16 6.35,28.26 6.35,27.94 6.03,27.94 JP5.15
N$22
  Top 0.254: U$1.27 13.65,30.68 13.65,27.62 12.38,27.62 12.38,25.72 JP1.9 JP5.18 JP5.17
N$23  (1 unrouted)
  Top 0.254: U$1.28 14.29,30.18 14.29,26.99 13.02,26.99 13.02,23.18 JP1.10 11.43,23.18 | JP5.20 JP5.19
N$24
  Top 0.254: U$1.29 14.92,29.67 14.92,26.35 13.65,26.35 13.65,22.54 12.38,22.54 12.38,20.64 JP1.11 JP5.22 JP5.21
N$25
  Top 0.254: U$1.30 15.56,29.19 15.56,25.72 14.29,25.72 14.29,21.91 13.02,21.91 13.02,18.1 JP1.12 JP5.24 JP5.23
N$26
  Top 0.254: U$1.31 16.19,28.68 16.19,25.08 14.92,25.08 14.92,21.27 13.65,21.27 13.65,17.46 12.38,17.46 12.38,15.56 JP1.13 JP5.26 JP5.25
N$27
  Top 0.254: U$1.32 16.83,28.17 16.83,24.45 15.56,24.45 15.56,20.64 14.29,20.64 14.29,16.83 13.02,16.83 13.02,13.02 JP1.14 JP5.28 JP5.27
N$29
  Top 0.254: 0.32,0.32 63.82,0.32 63.82,64.45 0.32,64.45 0.32,0.32
N$30
  Top 0.254: U$6.A R9.2
N$31
  Top 0.254: U$4.3 27.04,50.47 U$5.C
N$32
  Top 0.254: U$5.A R8.2
N$33  (via drill 0.5 pad 1.68)
  other vias: 6.35,58.42
N$34  (via drill 0.5 pad 1.68)
  other vias: 10.79,58.42
N$35
  Top 0.254: D2.4 35.87,7.94 41.59,7.94 41.59,12.35 D1.2
N$36
  Top 0.254: D2.2 39.07,6.67 42.55,6.67 42.55,10.2 D3.4
N$38
  Top 0.254: U$1.99 51.75,39.17 51.75,40.96 JP2.14 JP6.24 JP6.23
N$39
  Top 0.254: U$1.100 51.12,39.68 51.12,43.5 JP2.15 JP6.26 | JP6.26 JP6.25 | 53.34,43.5 JP6.26
N$40
  Top 0.254: U$1.101 50.48,40.18 50.48,46.04 JP2.16 JP6.28 | JP6.28 JP6.27 | 53.34,46.04 JP6.28
N$41
  Top 0.254: U$1.86 46.04,32.66 46.04,28.26 47.31,28.26 47.31,24.45 48.58,24.45 48.58,20.64 49.85,20.64 49.85,13.02 JP2.3 JP6.2 JP6.1
N$42
  Top 0.254: U$1.87 46.67,33.17 46.67,28.89 47.94,28.89 47.94,25.08 49.21,25.08 49.21,21.27 50.48,21.27 50.48,15.56 JP2.4 JP6.4 JP6.3
N$43
  Top 0.254: U$1.88 47.31,33.68 47.31,29.53 48.58,29.53 48.58,25.72 49.85,25.72 49.85,21.91 51.12,21.91 51.12,18.1 JP2.5 JP6.6 JP6.5
N$44
  Top 0.254: U$1.89 47.94,34.16 47.94,30.16 49.21,30.16 49.21,26.35 50.48,26.35 50.48,22.54 51.75,22.54 51.75,20.64 JP2.6 JP6.8 JP6.7
N$45
  Top 0.254: U$1.90 48.58,34.67 48.58,30.8 49.85,30.8 49.85,26.99 51.12,26.99 51.12,23.18 JP2.7 JP6.10 JP6.9
N$46
  Top 0.254: U$1.91 49.21,35.18 49.21,31.43 50.48,31.43 50.48,27.62 51.75,27.62 51.75,25.72 JP2.8 JP6.12 | JP6.12 JP6.11 | 53.34,25.72 JP6.12
N$47
  Top 0.254: U$1.92 49.85,35.69 49.85,32.07 51.12,32.07 51.12,28.26 JP2.9 JP6.14 | JP6.14 JP6.13 | 53.34,28.26 JP6.14
N$48
  Top 0.254: U$1.95 50.48,37.19 50.48,32.7 51.75,32.7 51.75,30.8 JP2.10 JP6.16 JP6.15
VCC
  Top 0.254: U$1.25 23.18,31.67 | 29.87,26.67 U$1.52 | 30.35,26.67 U$1.53 30.35,19.37 31.75,19.37 31.75,13.47 | U$1.6 23.18,41.17 | 23.18,41.17 30.35,41.17 | 30.35,41.17 30.35,36.17 | U$1.123 32.87,42.86 | 32.87,42.86 32.87,41.17 30.35,41.17 | U$1.93 38.42,36.17 | 38.42,36.17 30.35,36.17 | U$1.24 23.18,32.18 | 23.18,32.18 23.18,31.67 | U$1.45 26.35,24.31 26.35,26.67 | 26.35,26.67 29.87,26.67 | 29.87,26.67 30.35,26.67 | 23.18,31.67 23.18,26.67 | 23.18,26.67 26.35,26.67 | 39.37,26.67 39.37,27.18 U$1.75 43.83,27.18 R1.2 43.83,24.82 C3.2 45.72,25.08 | 39.37,26.67 U$1.71 | 30.35,26.67 34.37,26.67 | 34.37,26.67 U$1.61 | 34.37,26.67 39.37,26.67 | U$1.94 38.42,36.68 38.42,36.17 | U$1.134 27.36,42.86 32.87,42.86 | 23.18,41.17 23.18,41.68 U$1.5 15.88,41.68 15.88,41.17 | 32.87,42.86 36.86,42.86 U$1.115 36.86,48.19 U$2.VCC 37.01,49.53 | 30.35,36.17 23.18,36.17 23.18,32.18 | R4.2 44.45,48.58 | R5.2 42.55,48.58 | 42.55,48.58 40.96,48.58 | 40.96,48.58 40.96,44.77 39.37,43.18 36.83,43.18 | 23.18,26.67 20.62,24.43 20.62,23.81 R2.2 | 10.17,51.44 C4.2 9.53,51.12 | 10.17,51.44 JP3.VCC | 42.55,48.58 44.45,48.58 | 2.22,10.48 2.22,3.49 10.79,3.49 10.79,3.54 C1.2 | 2.22,10.48 2.22,47.94 11.75,47.94 | R9.1 11.75,49.53 | 11.75,49.53 11.75,51.44 10.17,51.44 | 11.75,49.53 11.75,47.94 | JP7.9 31.75,9.84 | 31.75,9.84 31.75,13.47 | 2.22,10.48 JP8.1 JP8.2 JP1.15 | JP4.4 40.96,54.29 40.96,50.8 | 40.96,50.8 40.96,48.58 | C2.2 40.96,50.8 | 44.45,48.58 46.36,48.58 46.36,52.07 JP9.5 | 11.75,47.94 15.24,47.94 15.24,43.18 | 15.24,43.18 15.24,41.17 15.88,41.17 | R3.2 15.24,43.18 | R6.2 15.88,40.64 15.88,41.17 | R8.1 32.38,50.48 32.38,49.53 37.01,49.53 | 37.01,49.53 U$2.EN | U$7.VCC 31.75,13.47
  Top 0.254: U$7.EN 36.71,12.35 D1.1 | 31.75,9.84 31.75,3.49 35.87,3.49 | 35.87,3.49 42.86,3.49 42.86,5.04 D3.1 | D2.1 35.87,3.49
  Top 0.406: U$7.EN U$7.VCC
  pour Top: 38.74,43.18 23.18,43.18 23.18,26.67 38.74,26.67

### Text on the board
Top: 9 | 1 | 1 CLK / 3 CONFDONE / 5 N_CONFIG / 7 N_STATUS / 9 DATA | VCC | GND